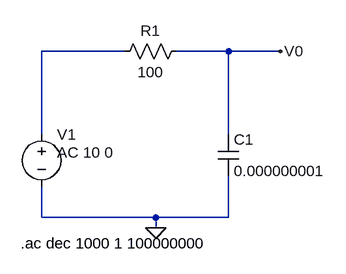
[diagram p0: schematic 1-krets-a.asc]
1-krets-a.asc, the LTspice schematic file:
Version 4
SHEET 1 880 680
WIRE 64 16 -64 16
WIRE 224 16 144 16
WIRE 304 16 224 16
WIRE -64 144 -64 16
WIRE 224 144 224 16
WIRE -64 272 -64 224
WIRE 112 272 -64 272
WIRE 224 272 224 208
WIRE 224 272 112 272
WIRE 112 288 112 272
FLAG 112 288 0
FLAG 304 16 V0
SYMBOL voltage -64 128 R0
WINDOW 3 24 160 Left 0
WINDOW 123 24 44 Left 0
WINDOW 39 0 0 Left 0
SYMATTR Value ""
SYMATTR Value2 AC 10 0
SYMATTR InstName V1
SYMBOL res 160 0 R90
WINDOW 0 0 56 VBottom 0
WINDOW 3 32 56 VTop 0
SYMATTR InstName R1
SYMATTR Value 100
SYMBOL cap 208 144 R0
SYMATTR InstName C1
SYMATTR Value 0.000000001
TEXT -96 312 Left 0 !.ac dec 1000 1 100000000

The netlist it stands for:
* 1-krets-a.asc
V1 N001 0 AC 10 0
R1 V0 N001 100
C1 V0 0 0.000000001
.ac dec 1000 1 100000000
.backanno
.end

* Results of the author's LTspice run, read from the files saved beside the schematic
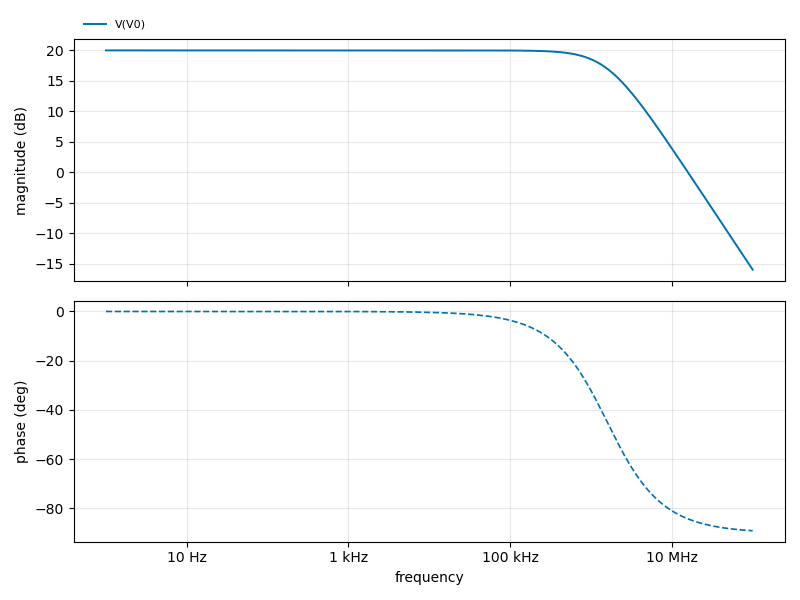
[diagram p1: AC Analysis of 1-krets-a.asc, plotted from the saved traces]
* AC Analysis, 1 run:
*   V(V0): 20.00 dB at 1 Hz, -15.96 dB at 100 MHz, peak 20.00 dB at 1 Hz, 3 dB below the peak at 1.592 MHz